# EAGLE schematic AC (EAGLE 7.6.0)
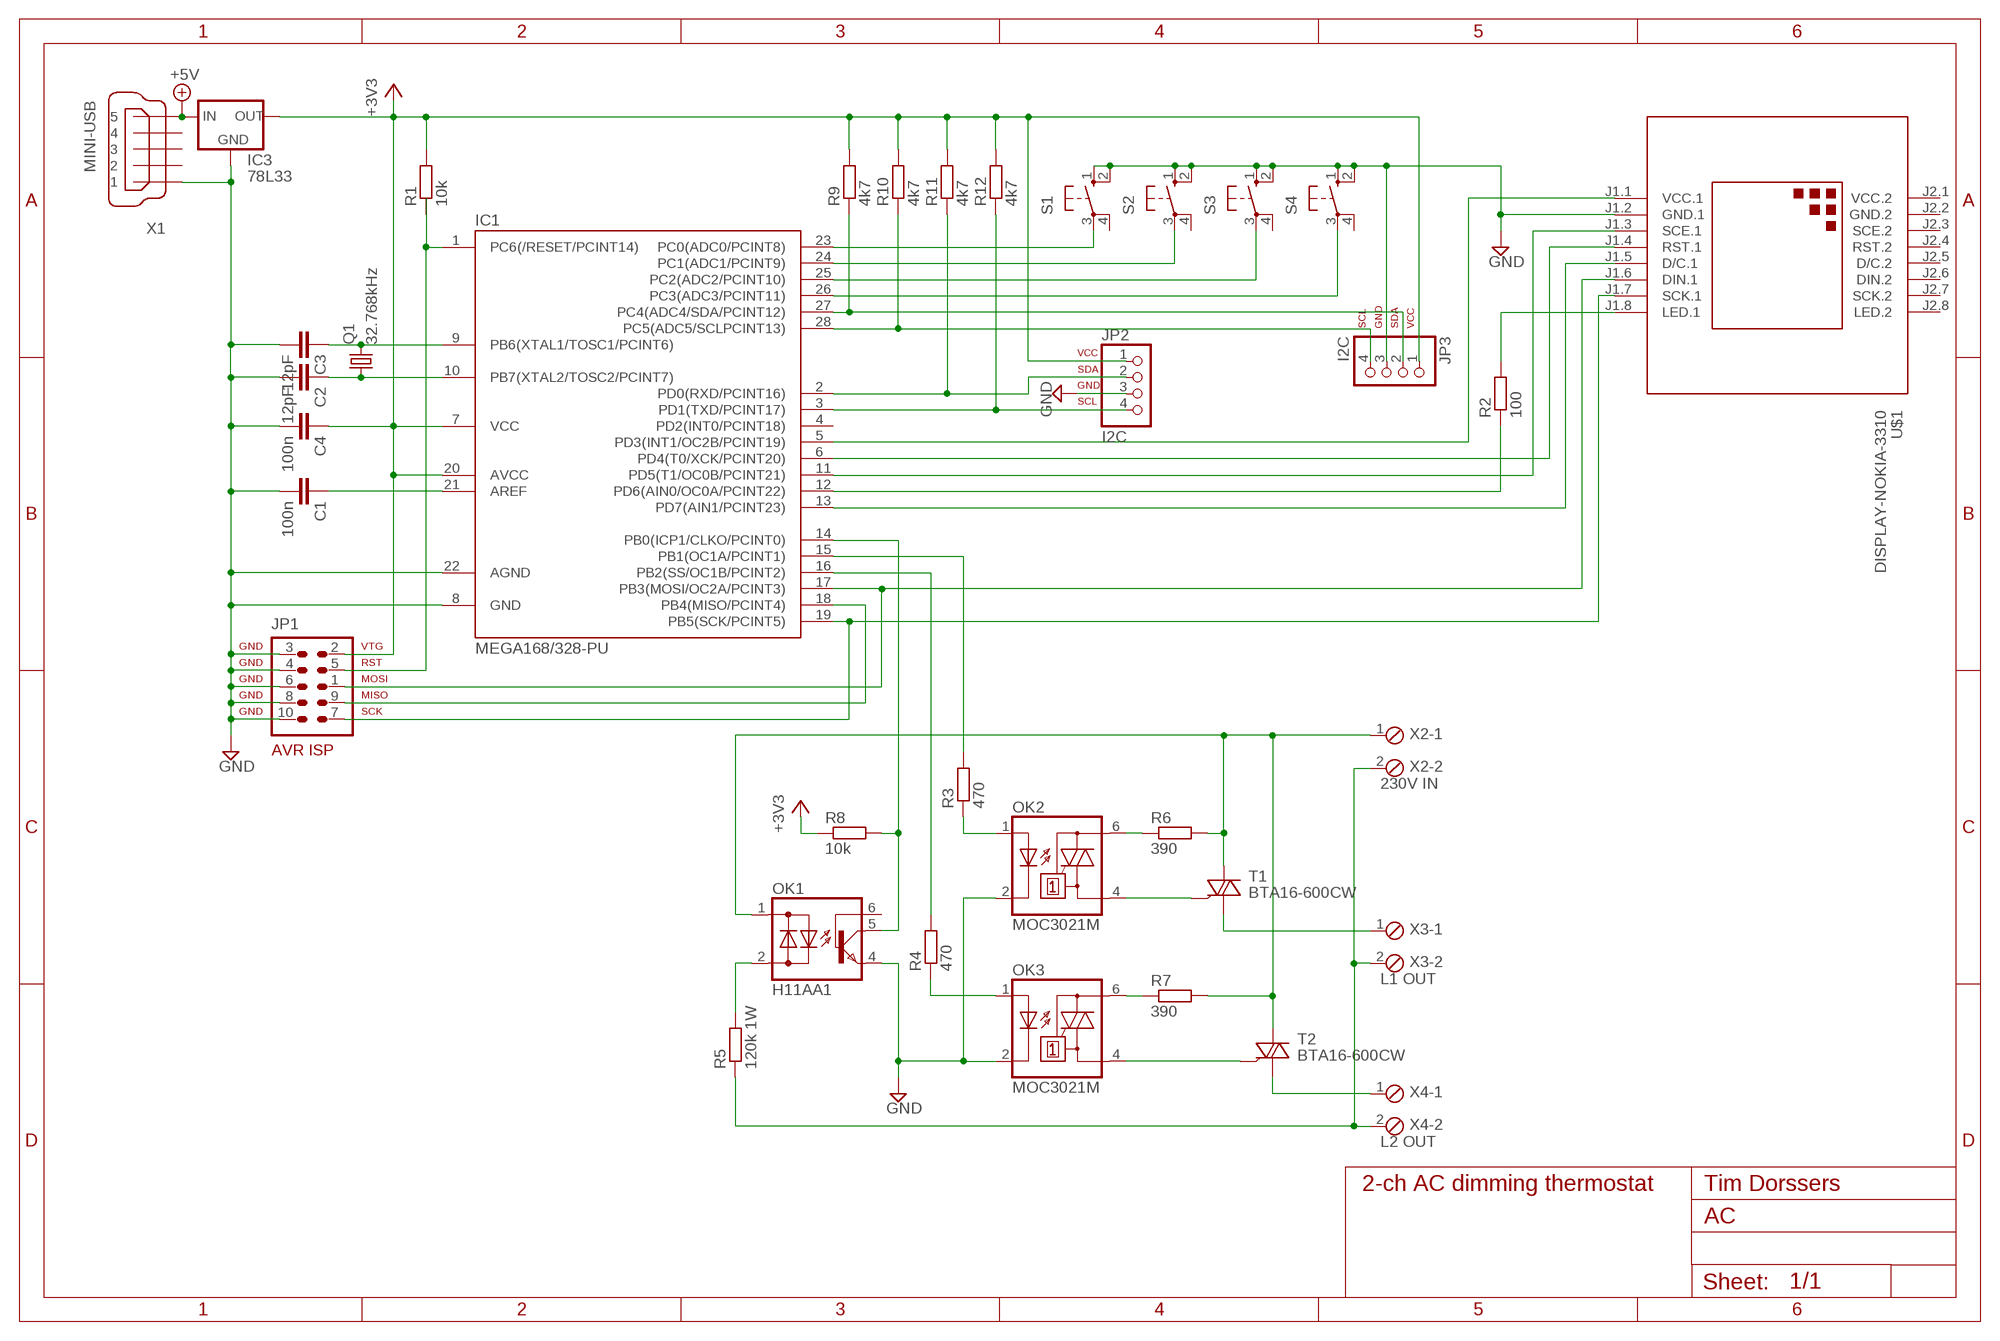
[diagram p0: schematic, sheet 1]

## Parts
C1  100n  C-EU025-025X050  [C025-025X050]
C2  12pF  C-EU025-024X044  [C025-024X044]
C3  12pF  C-EU025-024X044  [C025-024X044]
C4  100n  C-EU025-025X050  [C025-025X050]
IC1  MEGA168/328-PU  MEGA48/88/168-PU  [DIL28-3]
IC3  78L33  78LXX  [78LXX]
JP1  AVR-ISP-10  [AVR-ISP-10]
JP2  I2C  PINHD-1X4  [1X04]
JP3  I2C  PINHD-1X4  [1X04]
OK1  H11AA1  IL250  [DIL06]
OK2  MOC3021M  [DIL06]
OK3  MOC3021M  [DIL06]
Q1  32.768kHz  CRYSTALHC49U-V  [HC49U-V]
R1  10k  R-EU_0204/7  [0204/7]
R2  100  R-EU_0204/7  [0204/7]
R3  470  R-EU_0204/7  [0204/7]
R4  470  R-EU_0204/7  [0204/7]
R5  120k 1W  R-EU_0207/10  [0207/10]
R6  390  R-EU_0204/7  [0204/7]
R7  390  R-EU_0204/7  [0204/7]
R8  10k  R-EU_0207/10  [0207/10]
R9  4k7  R-EU_0204/7  [0204/7]
R10  4k7  R-EU_0204/7  [0204/7]
R11  4k7  R-EU_0204/7  [0204/7]
R12  4k7  R-EU_0204/7  [0204/7]
S1  10-XX  [B3F-10XX]
S2  10-XX  [B3F-10XX]
S3  10-XX  [B3F-10XX]
S4  10-XX  [B3F-10XX]
T1  BTA16-600CW  BT138-V  [TO220BV]
T2  BTA16-600CW  BT138-V  [TO220BV]
U$1  DISPLAY-NOKIA-3310  [DISPLAY-NOKIA-3310]
X1  MINI-USB  MINI-USB_SHIELD5P2-32005-601  [32005-601]
X2  230V IN  MPT2  [2POL254]
X3  L1 OUT  MPT2  [2POL254]
X4  L2 OUT  MPT2  [2POL254]

## Nets
+3V3: C4.1 IC1.7(VCC) IC1.20(AVCC) IC3.OUT JP1.2 JP2.1 JP3.1 R1.2 R8.1 R9.2 R10.2 R11.2 R12.2
+5V: IC3.IN X1.5
GND: C1.2 C2.2 C3.2 C4.2 IC1.8(GND) IC1.22(AGND) IC3.GND JP1.3 JP1.4 JP1.6 JP1.8 JP1.10 JP2.3 JP3.3 OK1.4(E) OK2.2(C) OK3.2(C) S1.1(S) S1.2(S1) S2.1(S) S2.2(S1) S3.1(S) S3.2(S1) S4.1(S) S4.2(S1) U$1.J1.2(GND.1) X1.1
N$1: OK1.2(AC2) R5.2
N$2: R2.2 U$1.J1.8(LED.1)
N$3: IC1.18(PB4(MISO/PCINT4)) JP1.9
N$4: IC1.17(PB3(MOSI/OC2A/PCINT3)) JP1.1 U$1.J1.6(DIN.1)
N$6: OK1.1(AC1) R6.2 R7.2 T1.T2(A2) T2.T2(A2) X2.1
N$7: R5.1 X2.2 X3.2 X4.2
N$8: IC1.13(PD7(AIN1/PCINT23)) U$1.J1.5(D/C.1)
N$9: IC1.6(PD4(T0/XCK/PCINT20)) U$1.J1.4(RST.1)
N$10: IC1.11(PD5(T1/OC0B/PCINT21)) U$1.J1.3(SCE.1)
N$11: IC1.14(PB0(ICP1/CLKO/PCINT0)) OK1.5(C) R8.2
N$12: IC1.12(PD6(AIN0/OC0A/PCINT22)) R2.1
N$13: IC1.23(PC0(ADC0/PCINT8)) S1.3(P)
N$14: IC1.24(PC1(ADC1/PCINT9)) S2.3(P)
N$15: IC1.2(PD0(RXD/PCINT16)) JP2.2 R11.1
N$16: IC1.3(PD1(TXD/PCINT17)) JP2.4 R12.1
N$17: IC1.25(PC2(ADC2/PCINT10)) S3.3(P)
N$18: IC1.26(PC3(ADC3/PCINT11)) S4.3(P)
N$19: IC1.1(PC6(/RESET/PCINT14)) JP1.5 R1.1
N$20: C3.1 IC1.9(PB6(XTAL1/TOSC1/PCINT6)) Q1.2
N$21: C2.1 IC1.10(PB7(XTAL2/TOSC2/PCINT7)) Q1.1
N$22: C1.1 IC1.21(AREF)
N$23: IC1.15(PB1(OC1A/PCINT1)) R3.2
N$24: OK2.1(A) R3.1
N$25: IC1.16(PB2(SS/OC1B/PCINT2)) R4.2
N$26: OK3.1(A) R4.1
N$27: T2.T1(A1) X4.1
N$28: IC1.27(PC4(ADC4/SDA/PCINT12)) JP3.2 R9.1
N$29: OK2.6(A2) R6.1
N$30: OK3.6(A2) R7.1
N$32: OK2.4(A1) T1.G
N$33: OK3.4(A1) T2.G
N$35: T1.T1(A1) X3.1
N$36: IC1.28(PC5(ADC5/SCLPCINT13)) JP3.4 R10.1
N$37: IC1.5(PD3(INT1/OC2B/PCINT19)) U$1.J1.1(VCC.1)
N$38: IC1.19(PB5(SCK/PCINT5)) JP1.7 U$1.J1.7(SCK.1)
Unconnected: IC1.4(PD2(INT0/PCINT18)) OK1.6(B) S1.4(P1) S2.4(P1) S3.4(P1) S4.4(P1) U$1.J2.3(SCE.2) U$1.J2.4(RST.2) U$1.J2.5(D/C.2) U$1.J2.6(DIN.2) U$1.J2.7(SCK.2) U$1.J2.8(LED.2) X1.2 X1.3 X1.4 X1.M1(S1) X1.M2(S2)

## Notes on the sheet
- SCL
  GND
  SDA
  VCC
- VCC
  SDA
  GND
  SCL
- 2-ch AC dimming thermostat | Tim Dorssers

## Power pins joined to a net without a drawn wire
GND.2: U$1.J2.2(GND.2)
VCC.2: U$1.J2.1(VCC.2)

## Library data of the parts
C1-C4 = rcl:C-EU: CAPACITOR, European symbol
IC1 = avr-7:MEGA48/88/168-PU
IC3 = v-reg:78LXX: VOLTAGE REGULATOR
JP1 = avr-7:AVR-ISP-10: AVR ISP-10 Serial Programming Header
JP2 JP3 = pinhead:PINHD-1X4: PIN HEADER
OK1 = optocoupler:IL250: SIEMENS OPTO COUPLER; MF: VISHAY/TELEFUNKEN; MPN: IL250; OC_FARNELL: 1469559; OC_NEWARK: 58K1705
OK2 OK3 = optocoupler:MOC30*M: RANDOM-PHASE OPTOISOLATORS TRIAC DRIVER OUTPUT Source: http://www.fairchildsemi.com MOC3020-M.pdf; MF: FAIRCHILD SEMICONDUCTOR; MPN: MOC3021-M; OC_FARNELL: 1021365; OC_NEWARK: 95B7895
Q1 = crystal:CRYSTAL: CRYSTAL
R1-R12 = resistor:R-EU_: RESISTOR, European symbol
S1-S4 = switch-omron:10-XX: OMRON SWITCH; MPN: B3F-1000; OC_FARNELL: 176432; OC_NEWARK: 36M3542
T1 T2 = triac:BT138: TRIAC Source: http://www.semiconductors.philips.com BT138_SERIES_2.pdf
U$1 = diy-modules:DISPLAY-NOKIA-3310: 84x48 Dot Matrix LCD Module based on Nokia 3310 display More details available here: https://arduinoandsoftware.wordpress.com/2012/12/30/nokia-33105110-3-3v-display-with-5v-arduino/
X1 = con-cypressindustries:MINI-USB_SHIELD5P2-: MINI USB-B R/A DIP 5pol. Source: www.cypressindustries.com; OC_FARNELL: unknown; OC_NEWARK: unknown
X2-X4 = con-phoenix-254:MPT2: PHOENIX CONNECTOR; OC_FARNELL: unknown; OC_NEWARK: unknown